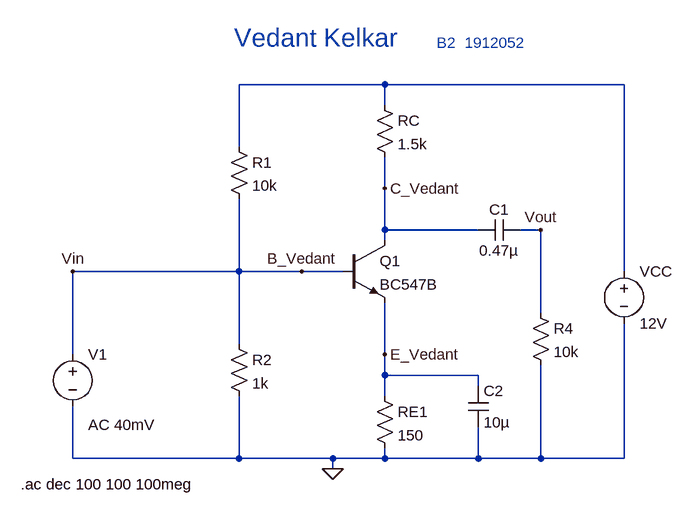
[diagram p0: schematic Draft43.asc]
Draft43.asc, the LTspice schematic file:
Version 4
SHEET 1 880 680
WIRE 176 -176 -48 -176
WIRE 544 -176 176 -176
WIRE 176 -144 176 -176
WIRE -48 -80 -48 -176
WIRE 176 -16 176 -64
WIRE 176 48 176 -16
WIRE 320 48 176 48
WIRE 416 48 384 48
WIRE 176 64 176 48
WIRE -48 112 -48 0
WIRE -48 112 -304 112
WIRE 48 112 -48 112
WIRE 112 112 48 112
WIRE 544 112 544 -176
WIRE 416 176 416 48
WIRE -48 224 -48 112
WIRE -304 240 -304 112
WIRE 176 240 176 160
WIRE 176 272 176 240
WIRE 320 272 176 272
WIRE 320 288 320 272
WIRE 176 304 176 272
WIRE -304 400 -304 320
WIRE -48 400 -48 304
WIRE -48 400 -304 400
WIRE 96 400 -48 400
WIRE 176 400 176 384
WIRE 176 400 96 400
WIRE 320 400 320 352
WIRE 320 400 176 400
WIRE 416 400 416 256
WIRE 416 400 320 400
WIRE 544 400 544 192
WIRE 544 400 416 400
WIRE 96 416 96 400
FLAG 96 416 0
FLAG 176 240 E_Vedant
FLAG 48 112 B_Vedant
FLAG 176 -16 C_Vedant
FLAG -304 112 Vin
FLAG 416 48 Vout
SYMBOL res -64 -96 R0
SYMATTR InstName R1
SYMATTR Value 10k
SYMBOL res -64 208 R0
SYMATTR InstName R2
SYMATTR Value 1k
SYMBOL res 160 -160 R0
SYMATTR InstName RC
SYMATTR Value 1.5k
SYMBOL res 160 288 R0
SYMATTR InstName RE1
SYMATTR Value 150
SYMBOL npn 112 64 R0
SYMATTR InstName Q1
SYMATTR Value BC547B
SYMBOL voltage 544 96 R0
SYMATTR InstName VCC
SYMATTR Value 12V
SYMBOL cap 384 32 R90
WINDOW 0 0 32 VBottom 2
WINDOW 3 32 32 VTop 2
SYMATTR InstName C1
SYMATTR Value 0.47µ
SYMBOL res 400 160 R0
SYMATTR InstName R4
SYMATTR Value 10k
SYMBOL cap 304 288 R0
SYMATTR InstName C2
SYMATTR Value 10µ
SYMBOL voltage -304 224 R0
WINDOW 123 24 124 Left 2
WINDOW 39 0 0 Left 0
SYMATTR InstName V1
SYMATTR Value ""
SYMATTR Value2 AC 40mV
TEXT -56 -248 Left 4 ;Vedant Kelkar
TEXT 256 -240 Left 2 ;B2  1912052
TEXT -384 440 Left 2 !.ac dec 100 100 100meg

The netlist it stands for:
* Draft43.asc
R1 N001 Vin 10k
R2 Vin 0 1k
RC N001 C_Vedant 1.5k
RE1 E_Vedant 0 150
Q1 C_Vedant Vin E_Vedant 0 BC547B
VCC N001 0 12V
C1 Vout C_Vedant 0.47µ
R4 Vout 0 10k
C2 E_Vedant 0 10µ
V1 Vin 0 AC 40mV
.model NPN NPN
.model PNP PNP
.lib standard.bjt
* Vedant Kelkar
* B2  1912052
.ac dec 100 100 100meg
.backanno
.end